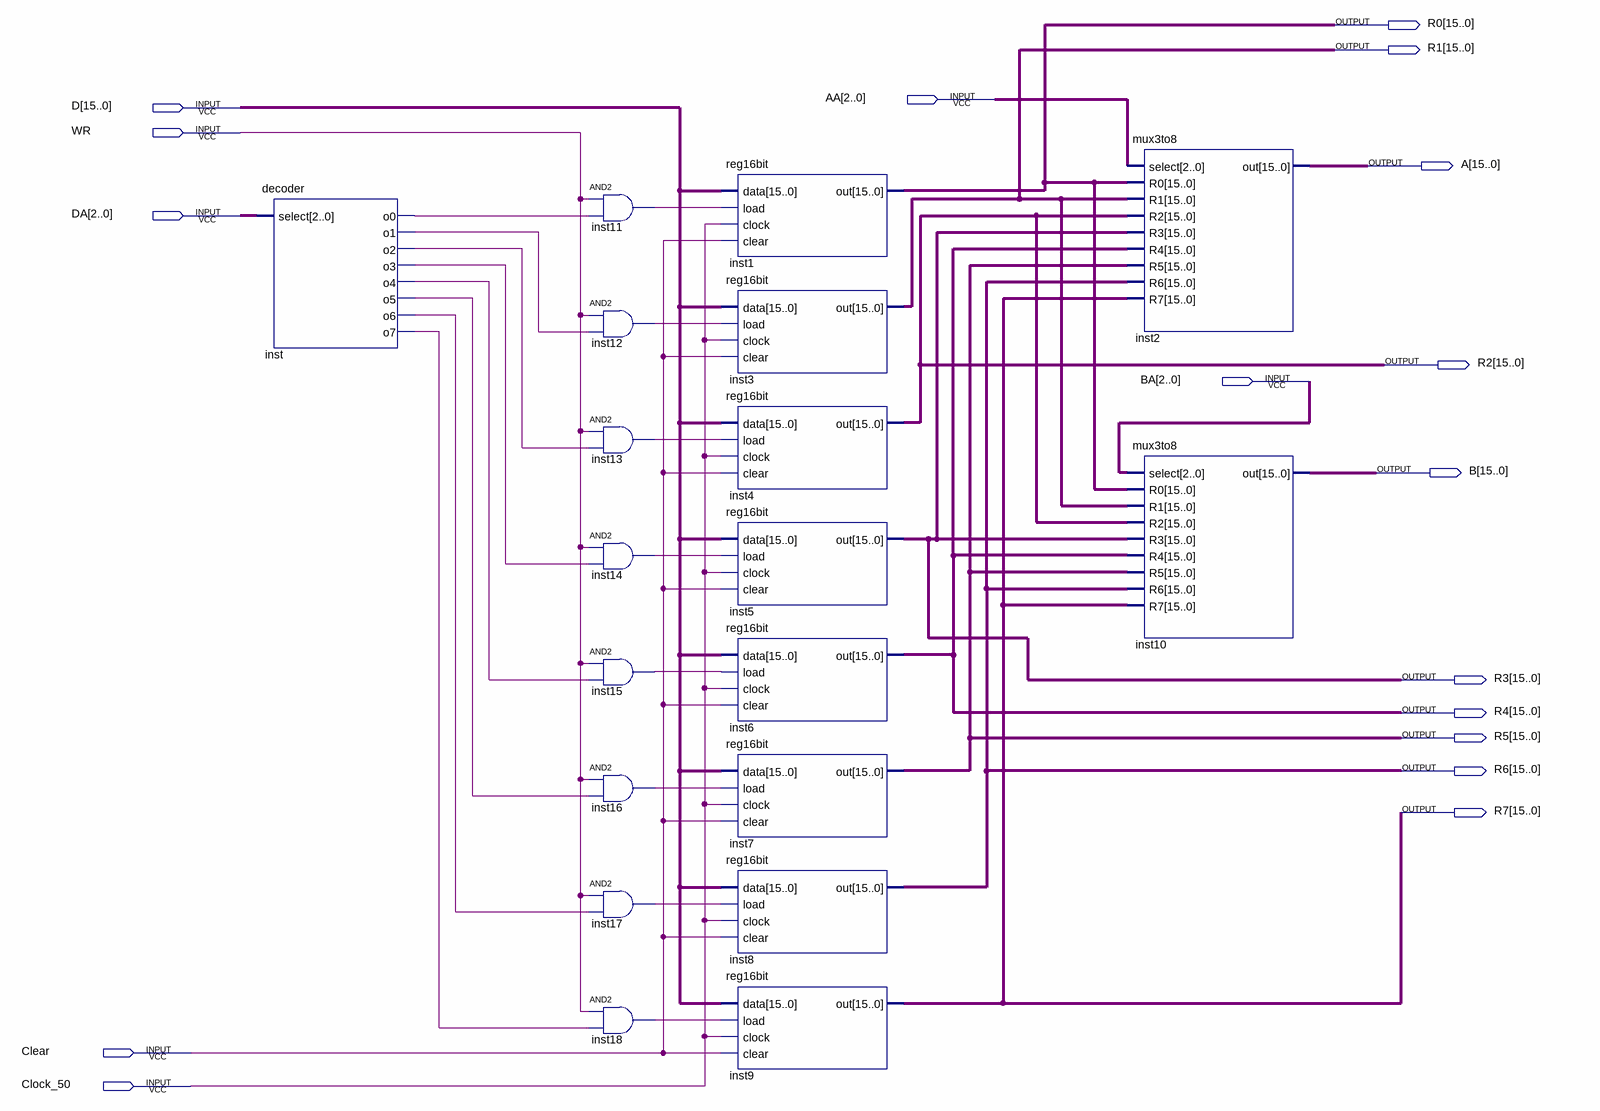
[diagram p0: schematic sheet]
// Quartus schematic RegisterFile.bdf as structural Verilog: 19 symbols, 17 pins
module RegisterFile (
  input  [2:0] AA,
  input  [15:0] D,
  input  WR,
  input  [2:0] DA,
  input  [2:0] BA,
  input  Clear,
  input  Clock_50,
  output [15:0] R0,
  output [15:0] R1,
  output [15:0] A,
  output [15:0] R2,
  output [15:0] B,
  output [15:0] R3,
  output [15:0] R4,
  output [15:0] R5,
  output [15:0] R6,
  output [15:0] R7
);

  wire inst11_out, inst12_out, inst13_out, inst14_out, inst15_out, inst16_out, inst17_out, inst18_out,
       inst_o0, inst_o1, inst_o2, inst_o3, inst_o4, inst_o5, inst_o6, inst_o7;

  decoder inst (
    .select(DA), .o0(inst_o0), .o1(inst_o1), .o2(inst_o2), .o3(inst_o3), .o4(inst_o4), .o5(inst_o5),
    .o6(inst_o6), .o7(inst_o7));
  and inst11 (inst11_out, WR, inst_o0);
  and inst12 (inst12_out, WR, inst_o1);
  and inst13 (inst13_out, WR, inst_o2);
  and inst14 (inst14_out, WR, inst_o3);
  and inst15 (inst15_out, WR, inst_o4);
  and inst16 (inst16_out, WR, inst_o5);
  and inst17 (inst17_out, WR, inst_o6);
  and inst18 (inst18_out, WR, inst_o7);
  reg16bit inst1 (.data(D), .load(inst11_out), .clock(Clock_50), .clear(Clear), .out(R0));
  reg16bit inst3 (.data(D), .load(inst12_out), .clock(Clock_50), .clear(Clear), .out(R1));
  reg16bit inst4 (.data(D), .load(inst13_out), .clock(Clock_50), .clear(Clear), .out(R2));
  reg16bit inst5 (.data(D), .load(inst14_out), .clock(Clock_50), .clear(Clear), .out(R3));
  reg16bit inst6 (.data(D), .load(inst15_out), .clock(Clock_50), .clear(Clear), .out(R4));
  reg16bit inst7 (.data(D), .load(inst16_out), .clock(Clock_50), .clear(Clear), .out(R5));
  reg16bit inst8 (.data(D), .load(inst17_out), .clock(Clock_50), .clear(Clear), .out(R6));
  reg16bit inst9 (.data(D), .load(inst18_out), .clock(Clock_50), .clear(Clear), .out(R7));
  mux3to8 inst2 (.select(AA), .R0(R0), .R1(R1), .R2(R2), .R3(R3), .R4(R4), .R5(R5), .R6(R6), .R7(R7), .out(A));
  mux3to8 inst10 (.select(BA), .R0(R0), .R1(R1), .R2(R2), .R3(R3), .R4(R4), .R5(R5), .R6(R6), .R7(R7), .out(B));
endmodule
